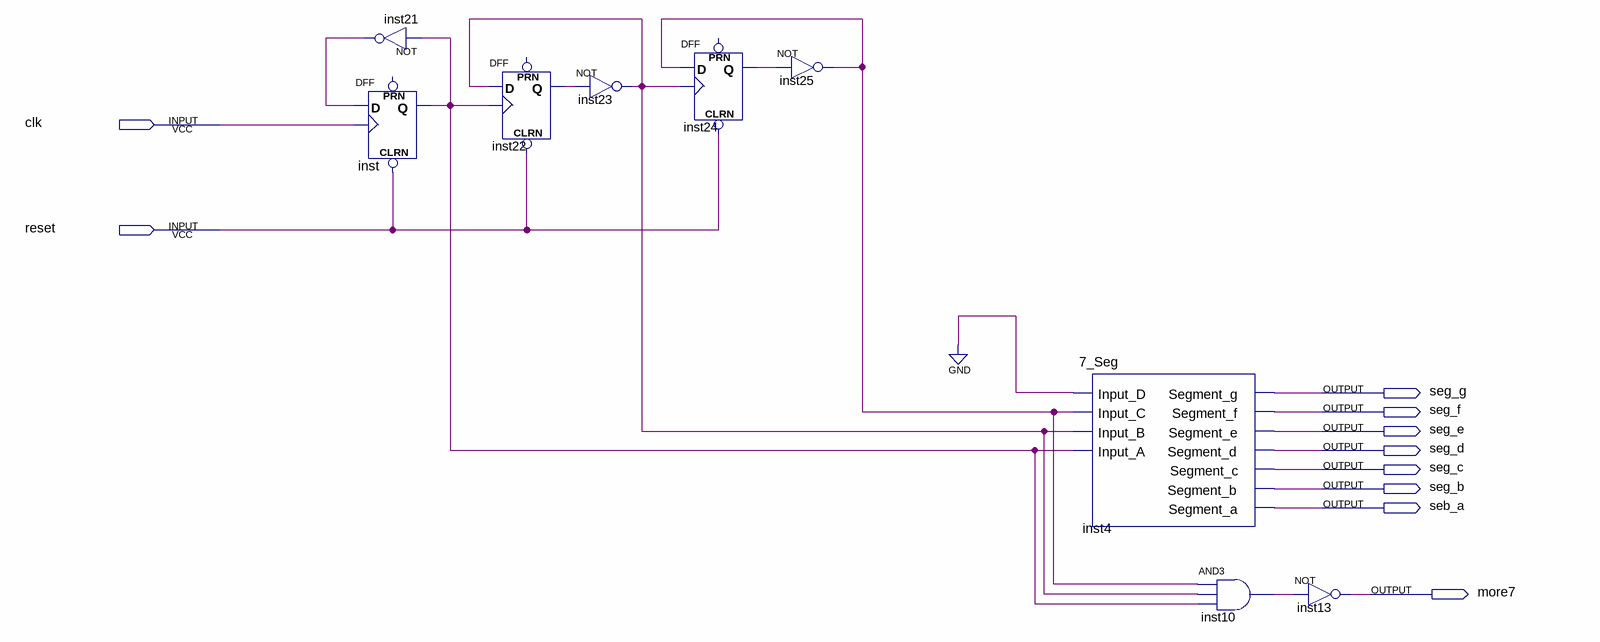
[diagram p0: schematic sheet]
// Quartus schematic ripple.bdf as structural Verilog: 9 symbols, 10 pins
module ripple (
  input  clk,
  input  reset,
  output seg_g,
  output seg_f,
  output seg_e,
  output seg_d,
  output seg_c,
  output seg_b,
  output seb_a,
  output more7
);

  wire inst10_out, inst21_out, inst22_q, inst23_out, inst24_q, inst25_out, inst_q;

  not inst21 (inst21_out, inst_q);
  DFF inst (.CLRN(reset), .CLK(clk), .D(inst21_out), .Q(inst_q));  // open: PRN
  DFF inst22 (.CLRN(reset), .CLK(inst_q), .D(inst23_out), .Q(inst22_q));  // open: PRN
  not inst23 (inst23_out, inst22_q);
  DFF inst24 (.CLRN(reset), .CLK(inst23_out), .D(inst25_out), .Q(inst24_q));  // open: PRN
  not inst25 (inst25_out, inst24_q);
  \7_Seg  inst4 (
    .Input_D(1'b0), .Input_C(inst25_out), .Input_B(inst23_out), .Input_A(inst_q), .Segment_g(seg_g),
    .Segment_f(seg_f), .Segment_e(seg_e), .Segment_d(seg_d), .Segment_c(seg_c), .Segment_b(seg_b),
    .Segment_a(seb_a));
  and inst10 (inst10_out, inst25_out, inst23_out, inst_q);
  not inst13 (more7, inst10_out);
endmodule
